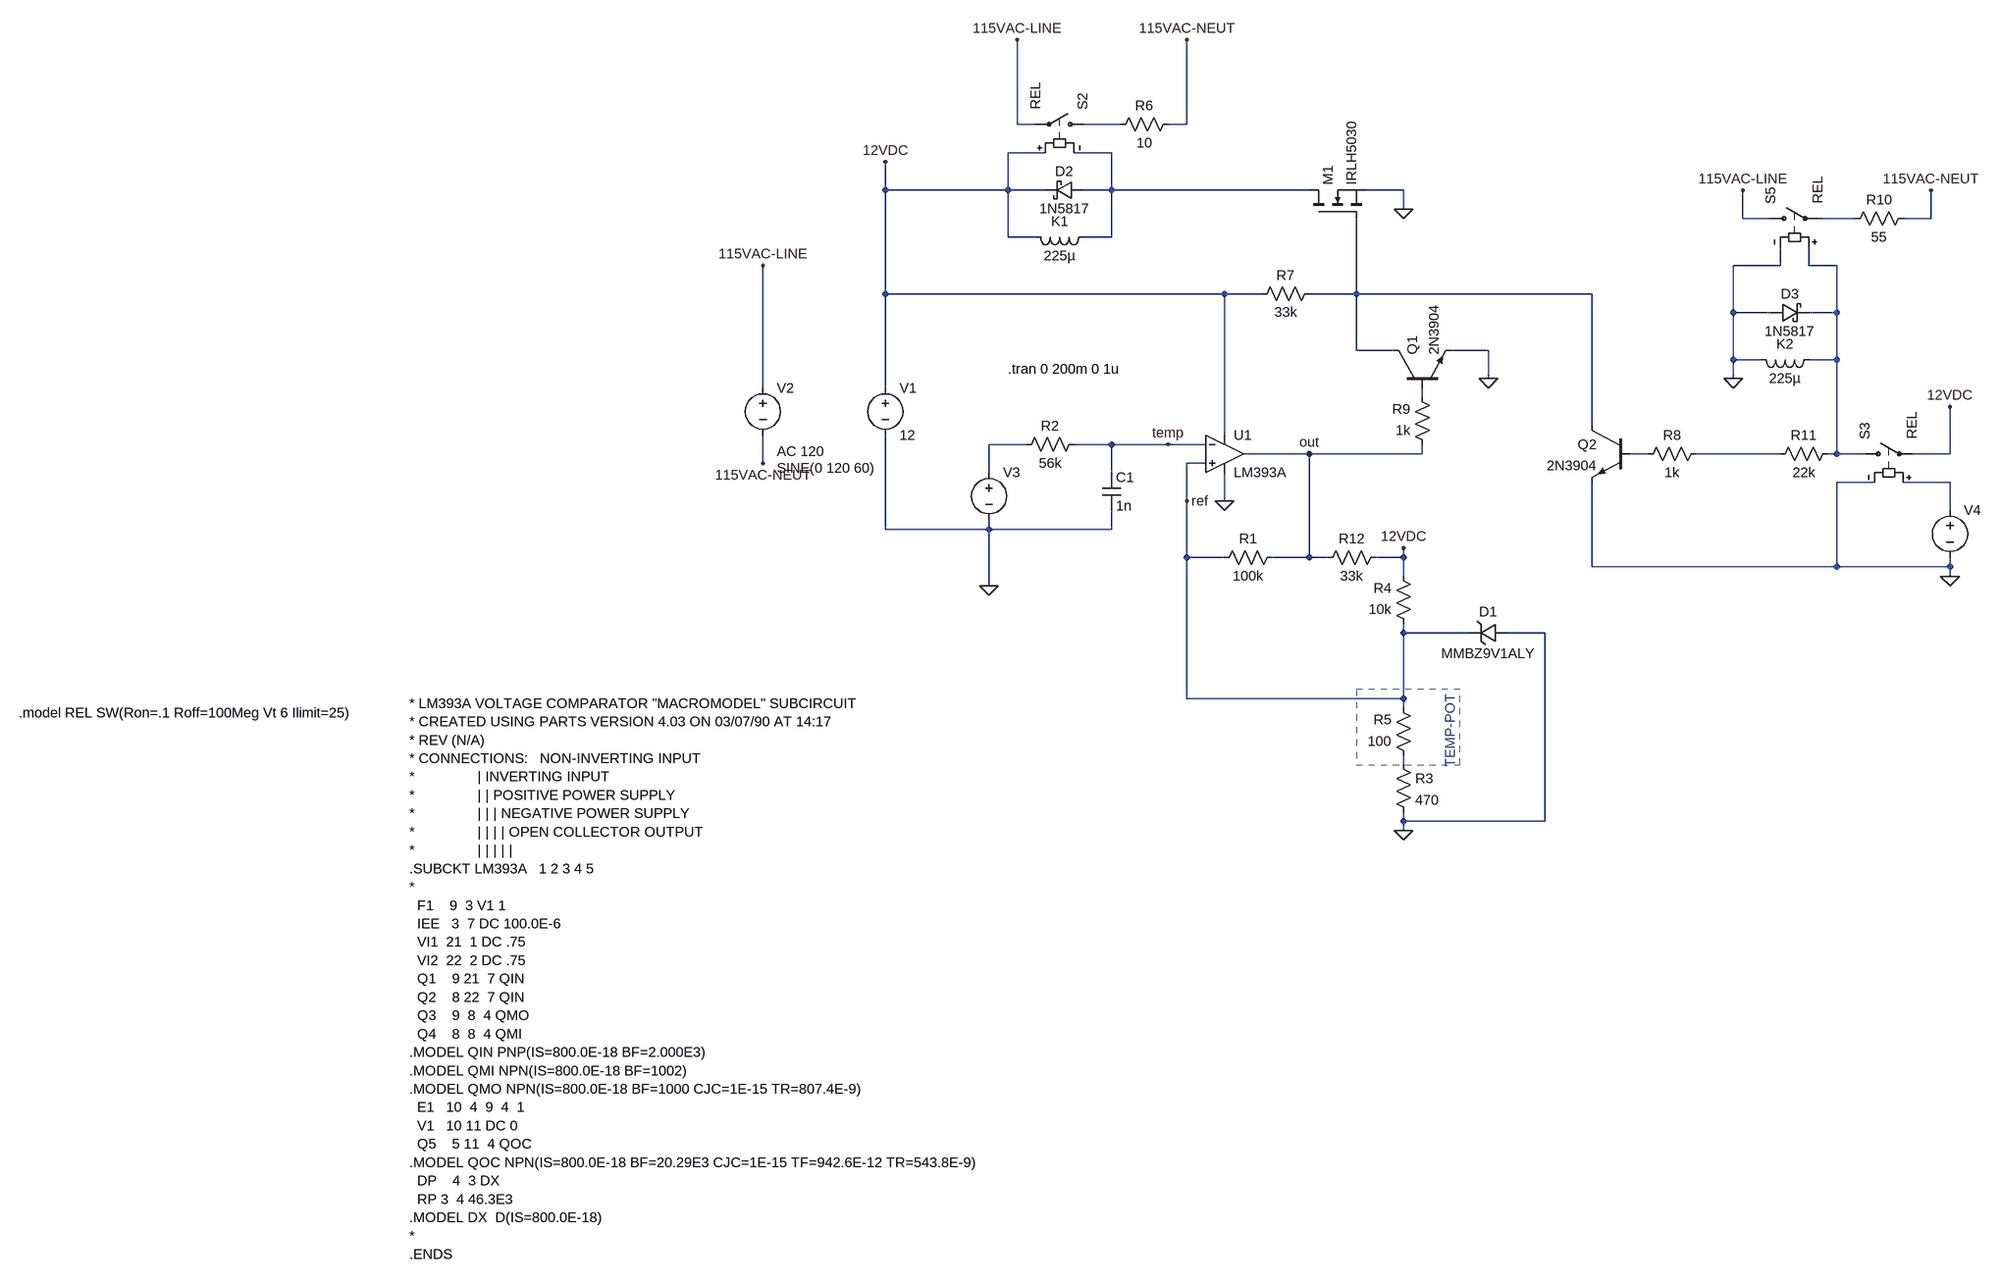
[diagram p0: schematic temperature-control-ltm84.asc]
temperature-control-ltm84.asc, the LTspice schematic file:
Version 4
SHEET 1 2212 2608
WIRE 304 -384 304 -528
WIRE 336 -384 304 -384
WIRE 480 -384 416 -384
WIRE 592 -384 592 -528
WIRE 592 -384 560 -384
WIRE 352 -336 288 -336
WIRE 464 -336 400 -336
WIRE 80 -272 80 -320
WIRE 288 -272 288 -336
WIRE 288 -272 80 -272
WIRE 352 -272 288 -272
WIRE 464 -272 464 -336
WIRE 464 -272 416 -272
WIRE 800 -272 464 -272
WIRE 960 -272 896 -272
WIRE 960 -240 960 -272
WIRE 1536 -224 1536 -272
WIRE 1584 -224 1536 -224
WIRE 1728 -224 1664 -224
WIRE 1856 -224 1856 -272
WIRE 1856 -224 1808 -224
WIRE 288 -192 288 -272
WIRE 336 -192 288 -192
WIRE 464 -192 464 -272
WIRE 464 -192 416 -192
WIRE 1600 -144 1600 -176
WIRE 1600 -144 1520 -144
WIRE 1648 -144 1648 -176
WIRE 1696 -144 1648 -144
WIRE 80 -96 80 -272
WIRE 656 -96 80 -96
WIRE 720 -96 656 -96
WIRE 880 -96 880 -224
WIRE 880 -96 800 -96
WIRE 1280 -96 880 -96
WIRE 1520 -64 1520 -144
WIRE 1584 -64 1520 -64
WIRE 1696 -64 1696 -144
WIRE 1696 -64 1648 -64
WIRE 880 0 880 -96
WIRE 944 0 880 0
WIRE 1104 0 1040 0
WIRE 1520 16 1520 -64
WIRE 1568 16 1520 16
WIRE 1696 16 1696 -64
WIRE 1696 16 1648 16
WIRE 1104 48 1104 0
WIRE 1520 48 1520 16
WIRE -128 64 -128 -144
WIRE 80 64 80 -96
WIRE 992 80 992 64
WIRE 1280 128 1280 -96
WIRE 656 144 656 -96
WIRE 320 160 256 160
WIRE 464 160 400 160
WIRE 560 160 464 160
WIRE 624 160 560 160
WIRE -128 192 -128 144
WIRE 800 176 688 176
WIRE 992 176 992 160
WIRE 992 176 800 176
WIRE 1376 176 1344 176
WIRE 1600 176 1456 176
WIRE 1696 176 1696 16
WIRE 1696 176 1680 176
WIRE 1744 176 1696 176
WIRE 1888 176 1888 96
WIRE 1888 176 1824 176
WIRE 624 192 592 192
WIRE 256 208 256 160
WIRE 464 208 464 160
WIRE 1760 224 1696 224
WIRE 1888 224 1808 224
WIRE 592 256 592 192
WIRE 656 256 656 208
WIRE 1888 272 1888 224
WIRE 80 304 80 144
WIRE 256 304 256 288
WIRE 256 304 80 304
WIRE 464 304 464 272
WIRE 464 304 256 304
WIRE 592 352 592 256
WIRE 656 352 592 352
WIRE 800 352 800 176
WIRE 800 352 736 352
WIRE 832 352 800 352
WIRE 960 352 960 336
WIRE 960 352 912 352
WIRE 1280 368 1280 224
WIRE 1696 368 1696 224
WIRE 1696 368 1280 368
WIRE 1888 368 1888 352
WIRE 1888 368 1696 368
WIRE 960 384 960 352
WIRE 1888 384 1888 368
WIRE 256 400 256 304
WIRE 960 480 960 464
WIRE 1072 480 960 480
WIRE 1200 480 1136 480
WIRE 592 592 592 352
WIRE 960 592 960 480
WIRE 960 592 592 592
WIRE 960 608 960 592
WIRE 960 704 960 688
WIRE 960 800 960 784
WIRE 1200 800 1200 480
WIRE 1200 800 960 800
WIRE 960 816 960 800
FLAG 256 400 0
FLAG 800 176 out
FLAG 1104 48 0
FLAG 656 256 0
FLAG 960 816 0
FLAG 960 336 12VDC
FLAG 560 160 temp
FLAG 592 256 ref
FLAG 80 -320 12VDC
FLAG -128 -144 115VAC-LINE
FLAG -128 192 115VAC-NEUT
FLAG 304 -528 115VAC-LINE
FLAG 592 -528 115VAC-NEUT
FLAG 1888 384 0
FLAG 1888 96 12VDC
FLAG 1520 48 0
FLAG 1536 -272 115VAC-LINE
FLAG 1856 -272 115VAC-NEUT
FLAG 960 -240 0
DATAFLAG 768 592 ""
SYMBOL voltage 80 48 R0
WINDOW 123 0 0 Left 0
WINDOW 39 0 0 Left 0
SYMATTR InstName V1
SYMATTR Value 12
SYMBOL OpAmps\\opamp2 656 112 R0
SYMATTR InstName U1
SYMATTR Value LM393A
SYMBOL res 816 -112 R90
WINDOW 0 0 56 VBottom 2
WINDOW 3 32 56 VTop 2
SYMATTR InstName R7
SYMATTR Value 33k
SYMBOL npn 944 64 R270
SYMATTR InstName Q1
SYMATTR Value 2N3904
SYMBOL cap 448 208 R0
SYMATTR InstName C1
SYMATTR Value 1n
SYMBOL ind 432 -208 R90
WINDOW 0 5 56 VBottom 2
WINDOW 3 32 56 VTop 2
SYMATTR InstName K1
SYMATTR Value 225µ
SYMATTR SpiceLine Rser=250
SYMBOL nmos 800 -224 R270
SYMATTR InstName M1
SYMATTR Value IRLH5030
SYMBOL voltage 256 192 R0
WINDOW 3 -564 217 Invisible 2
WINDOW 123 0 0 Left 0
WINDOW 39 0 0 Left 0
SYMATTR Value PULSE(.925 .5 10m 80m 20m 60m 200m 1)
SYMATTR InstName V3
SYMBOL res 976 480 R180
WINDOW 0 36 76 Left 2
WINDOW 3 36 40 Left 2
SYMATTR InstName R4
SYMATTR Value 10k
SYMBOL res 816 368 R270
WINDOW 0 32 56 VTop 2
WINDOW 3 0 56 VBottom 2
SYMATTR InstName R12
SYMATTR Value 33k
SYMBOL res 752 336 R90
WINDOW 0 0 56 VBottom 2
WINDOW 3 32 56 VTop 2
SYMATTR InstName R1
SYMATTR Value 100k
SYMBOL res 416 144 R90
WINDOW 0 0 56 VBottom 2
WINDOW 3 32 56 VTop 2
SYMATTR InstName R2
SYMATTR Value 56k
SYMBOL res 944 688 R0
SYMATTR InstName R3
SYMATTR Value 470
SYMBOL zener 1136 464 R90
WINDOW 0 -4 32 VBottom 2
WINDOW 3 36 32 VTop 2
SYMATTR InstName D1
SYMATTR Value MMBZ9V1ALY
SYMATTR Description Diode
SYMATTR Type diode
SYMBOL res 976 704 R180
WINDOW 0 36 76 Left 2
WINDOW 3 36 40 Left 2
SYMATTR InstName R5
SYMATTR Value 100
SYMBOL sw 432 -384 M270
SYMATTR InstName S2
SYMATTR Value REL
SYMBOL res 576 -400 R90
WINDOW 0 0 56 VBottom 2
WINDOW 3 32 56 VTop 2
SYMATTR InstName R6
SYMATTR Value 10
SYMBOL voltage 1888 256 R0
WINDOW 3 -564 217 Invisible 2
WINDOW 123 0 0 Left 0
WINDOW 39 0 0 Left 0
SYMATTR Value PULSE(0 12 5m 10u 10u 15m 0 1)
SYMATTR InstName V4
SYMBOL sw 1728 176 R270
SYMATTR InstName S3
SYMATTR Value REL
SYMBOL res 1008 176 R180
WINDOW 0 36 76 Left 2
WINDOW 3 36 40 Left 2
SYMATTR InstName R9
SYMATTR Value 1k
SYMBOL npn 1344 128 M0
SYMATTR InstName Q2
SYMATTR Value 2N3904
SYMBOL res 1360 192 R270
WINDOW 0 32 56 VTop 2
WINDOW 3 0 56 VBottom 2
SYMATTR InstName R8
SYMATTR Value 1k
SYMBOL ind 1664 0 R90
WINDOW 0 5 56 VBottom 2
WINDOW 3 32 56 VTop 2
SYMATTR InstName K2
SYMATTR Value 225µ
SYMATTR SpiceLine Rser=250
SYMBOL schottky 1584 -48 R270
WINDOW 0 32 32 VTop 2
WINDOW 3 0 32 VBottom 2
SYMATTR InstName D3
SYMATTR Value 1N5817
SYMATTR Description Diode
SYMATTR Type diode
SYMBOL sw 1568 -224 R270
SYMATTR InstName S5
SYMATTR Value REL
SYMBOL res 1824 -240 R90
WINDOW 0 0 56 VBottom 2
WINDOW 3 32 56 VTop 2
SYMATTR InstName R10
SYMATTR Value 55
SYMBOL schottky 416 -288 R90
WINDOW 0 0 32 VBottom 2
WINDOW 3 32 32 VTop 2
SYMATTR InstName D2
SYMATTR Value 1N5817
SYMATTR Description Diode
SYMATTR Type diode
SYMBOL res 1584 192 R270
WINDOW 0 32 56 VTop 2
WINDOW 3 0 56 VBottom 2
SYMATTR InstName R11
SYMATTR Value 22k
SYMBOL voltage -128 48 R0
WINDOW 3 24 152 Left 2
WINDOW 123 24 124 Left 2
WINDOW 39 0 0 Left 0
SYMATTR InstName V2
SYMATTR Value SINE(0 120 60)
SYMATTR Value2 AC 120
TEXT 288 32 Left 2 !.tran 0 200m 0 1u
TEXT -728 600 Left 2 !* LM393A VOLTAGE COMPARATOR "MACROMODEL" SUBCIRCUIT\n* CREATED USING PARTS VERSION 4.03 ON 03/07/90 AT 14:17\n* REV (N/A)\n* CONNECTIONS:   NON-INVERTING INPUT\n*                | INVERTING INPUT\n*                | | POSITIVE POWER SUPPLY\n*                | | | NEGATIVE POWER SUPPLY\n*                | | | | OPEN COLLECTOR OUTPUT\n*                | | | | |\n.SUBCKT LM393A   1 2 3 4 5\n*\n  F1    9  3 V1 1\n  IEE   3  7 DC 100.0E-6\n  VI1  21  1 DC .75\n  VI2  22  2 DC .75\n  Q1    9 21  7 QIN\n  Q2    8 22  7 QIN\n  Q3    9  8  4 QMO\n  Q4    8  8  4 QMI\n.MODEL QIN PNP(IS=800.0E-18 BF=2.000E3)\n.MODEL QMI NPN(IS=800.0E-18 BF=1002)\n.MODEL QMO NPN(IS=800.0E-18 BF=1000 CJC=1E-15 TR=807.4E-9)\n  E1   10  4  9  4  1\n  V1   10 11 DC 0\n  Q5    5 11  4 QOC\n.MODEL QOC NPN(IS=800.0E-18 BF=20.29E3 CJC=1E-15 TF=942.6E-12 TR=543.8E-9)\n  DP    4  3 DX\n  RP 3  4 46.3E3\n.MODEL DX  D(IS=800.0E-18)\n*\n.ENDS
TEXT -1640 616 Left 2 !.model REL SW(Ron=.1 Roff=100Meg Vt 6 Ilimit=25)
TEXT 1040 584 VRight 2 ;TEMP-POT
RECTANGLE Normal 880 704 1056 576 2

The netlist it stands for:
* temperature-control-ltm84.asc
V1 12VDC 0 12
XU1 ref temp 12VDC 0 out LM393A  ; pins In+ In- V+ V- OUT
R7 N005 12VDC 33k
Q1 N005 N006 0 0 2N3904
C1 temp 0 1n
L§K1 N002 12VDC 225µ Rser=250
M1 N002 N005 0 0 IRLH5030
V3 N007 0 PULSE(.925 .5 10m 80m 20m 60m 200m 1)
R4 ref 12VDC 10k
R12 out 12VDC 33k
R1 out ref 100k
R2 temp N007 56k
R3 N011 0 470
D1 0 ref MMBZ9V1ALY
R5 N011 ref 100
S2 N001 115VAC-LINE 12VDC N002 REL
R6 115VAC-NEUT N001 10
V4 N010 0 PULSE(0 12 5m 10u 10u 15m 0 1)
S3 N004 12VDC N010 0 REL
R9 out N006 1k
Q2 N005 N008 0 0 2N3904
R8 N008 N009 1k
L§K2 N004 0 225µ Rser=250
D3 0 N004 1N5817
S5 115VAC-LINE N003 N004 0 REL
R10 115VAC-NEUT N003 55
D2 N002 12VDC 1N5817
R11 N009 N004 22k
V2 115VAC-LINE 115VAC-NEUT SINE(0 120 60) AC 120
.model D D
.lib standard.dio
.model NPN NPN
.model PNP PNP
.lib standard.bjt
.model NMOS NMOS
.model PMOS PMOS
.lib standard.mos
.tran 0 200m 0 1u
* LM393A VOLTAGE COMPARATOR "MACROMODEL" SUBCIRCUIT
* CREATED USING PARTS VERSION 4.03 ON 03/07/90 AT 14:17
* REV (N/A)
* CONNECTIONS:   NON-INVERTING INPUT
*                | INVERTING INPUT
*                | | POSITIVE POWER SUPPLY
*                | | | NEGATIVE POWER SUPPLY
*                | | | | OPEN COLLECTOR OUTPUT
*                | | | | |
.SUBCKT LM393A   1 2 3 4 5
*
  F1    9  3 V1 1
  IEE   3  7 DC 100.0E-6
  VI1  21  1 DC .75
  VI2  22  2 DC .75
  Q1    9 21  7 QIN
  Q2    8 22  7 QIN
  Q3    9  8  4 QMO
  Q4    8  8  4 QMI
.MODEL QIN PNP(IS=800.0E-18 BF=2.000E3)
.MODEL QMI NPN(IS=800.0E-18 BF=1002)
.MODEL QMO NPN(IS=800.0E-18 BF=1000 CJC=1E-15 TR=807.4E-9)
  E1   10  4  9  4  1
  V1   10 11 DC 0
  Q5    5 11  4 QOC
.MODEL QOC NPN(IS=800.0E-18 BF=20.29E3 CJC=1E-15 TF=942.6E-12 TR=543.8E-9)
  DP    4  3 DX
  RP 3  4 46.3E3
.MODEL DX  D(IS=800.0E-18)
*
.ENDS
.model REL SW(Ron=.1 Roff=100Meg Vt 6 Ilimit=25)
* TEMP-POT
.backanno
.end